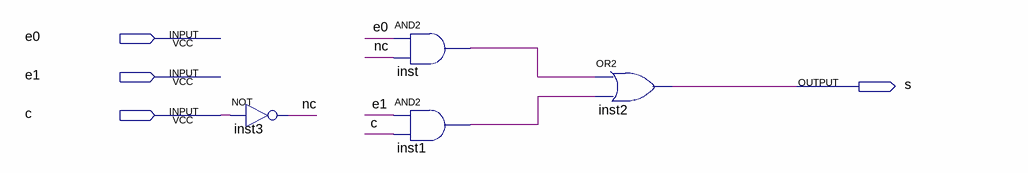
[diagram p0: schematic sheet]
// Quartus schematic jpd_mux_2x1.bdf as structural Verilog: 4 symbols, 4 pins
module jpd_mux_2x1 (
  input  e0,
  input  e1,
  input  c,
  output s
);

  wire inst1_out, inst_out, nc;

  not inst3 (nc, c);
  and inst (inst_out, e0, nc);
  and inst1 (inst1_out, e1, c);
  or inst2 (s, inst_out, inst1_out);
endmodule
